# Altium schematic sheet Sheet1.SchDoc
size A; SheetNumber: 1; SheetTotal: 1
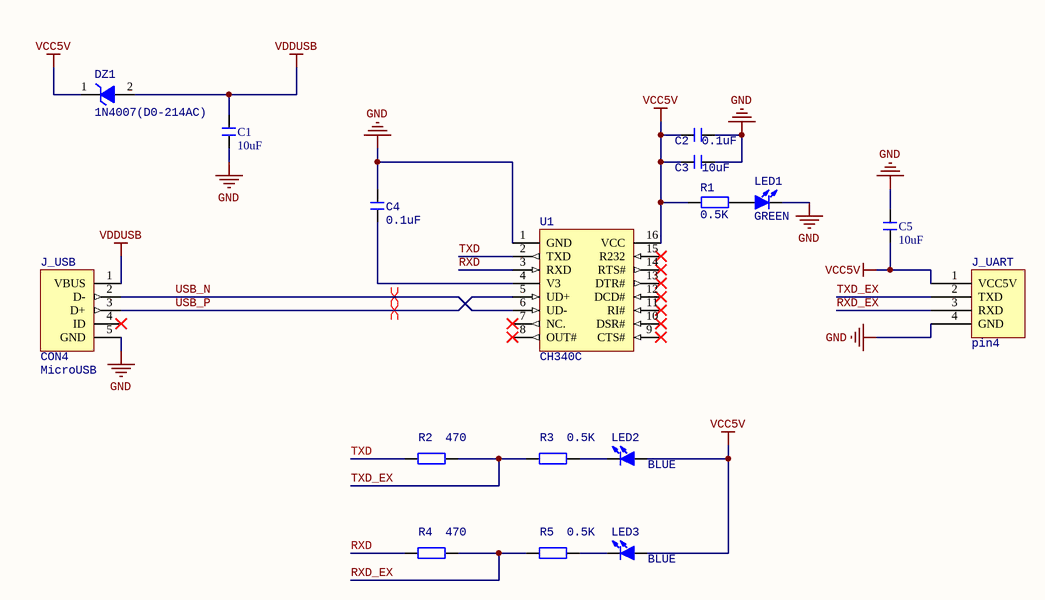
[diagram p0: Sheet1.SchDoc]

## Parts
C1  10uF  [C 0603_M]
C2  0.1uF  [C 0402_M]
C3  10uF  [C 0603_M]
C4  0.1uF  [C 0402_M]
C5  10uF  [C 0603_M]
DZ1  1N4007(D0-214AC)  [D SMA(DO-214AC)]
J_UART  pin4  [HDR2.54-LI-4P]
J_USB  CON4  [MicroUsb_C404969]
LED1  GREEN  [D 0402]
LED2  BLUE  [D 0402]
LED3  BLUE  [D 0402]
R1  0.5K  [R 0402R]
R2  470  [R 0402R]
R3  0.5K  [R 0402R]
R4  470  [R 0402R]
R5  0.5K  [R 0402R]
U1  CH340C  [SOP-16_150mil]

## Nets
GND: C1.1 C2.2 C3.2 C4.2 C5.2 J_UART.4(GND) J_USB.5(GND) LED1.2(K) U1.1(GND)
VCC5V: C2.1 C3.1 C5.1 DZ1.1(K) J_UART.1(VCC5V) LED2.1(A) LED3.1(A) R1.1 U1.16(VCC)
VDDUSB: C1.2 DZ1.2(A) J_USB.1(VBUS)
RXD: R4.1 U1.3(RXD)
RXD_EX: J_UART.3(RXD) R4.2 R5.1
TXD: R2.1 U1.2(TXD)
TXD_EX: J_UART.2(TXD) R2.2 R3.1
USB_N: J_USB.2(D-) U1.6(UD-)
USB_P: J_USB.3(D+) U1.5(UD+)
NetC4_1: C4.1 U1.4(V3)
NetLED1_1: LED1.1(A) R1.2
NetLED2_2: LED2.2(K) R3.2
NetLED3_2: LED3.2(K) R5.2

Not connected (* = marked no-connect by the designer): J_USB 4(ID)*; U1 7(NC.)* 8(OUT#)* 9(CTS#)* 10(DSR#)* 11(RI#)* 12(DCD#)* 13(DTR#)* 14(RTS#)* 15(R232)*

## Layout directives
differential pair: USB_N, USB_P

## Notes on the sheet
- (near J_USB) MicroUSB

## Library data of the parts
C1-C5 = C: 无极性贴片电容; 版权归属: 源创客; BOM名称: 无极性贴片电容; 学习资源: www.ooocke.com
DZ1 = DZ: 稳压二极管; BOM名称: 3V/0.5W稳压管; 版权归属: 源创客; 学习资源: www.ooocke.com
J_USB = MicroUSB_5P
LED1-LED3 = LED-SMD: 贴片LED; 版权归属: 源创客; BOM名称: 贴片LED; 学习资源: www.ooocke.com
R1-R5 = R: 贴片电阻
U1 = CH340C: CH340 是一个 USB 总线的转接芯片，实现 USB 转串口或者 USB 转打印口。